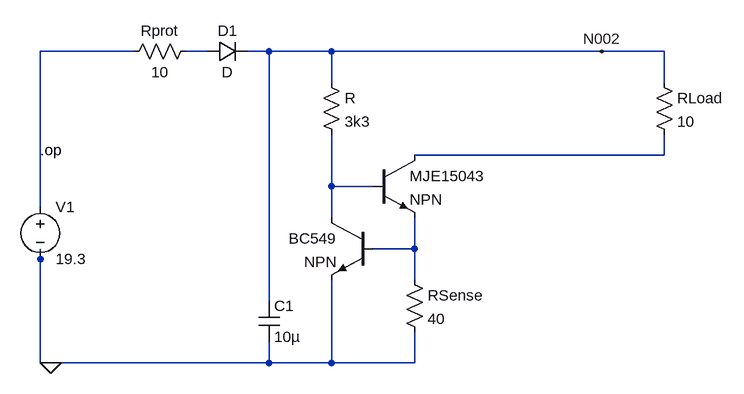
[diagram p0: schematic tty-20ma-current-source.asc]
tty-20ma-current-source.asc, the LTspice schematic file:
Version 4
SHEET 1 880 680
WIRE -64 16 -208 16
WIRE 48 16 16 16
WIRE 144 16 112 16
WIRE 240 16 144 16
WIRE 656 16 240 16
WIRE 752 16 656 16
WIRE 240 64 240 16
WIRE 752 64 752 16
WIRE 752 176 752 144
WIRE 752 176 368 176
WIRE 240 224 240 144
WIRE 304 224 240 224
WIRE -208 256 -208 16
WIRE 240 272 240 224
WIRE 368 320 368 272
WIRE 368 320 304 320
WIRE -208 336 -208 320
WIRE 368 368 368 320
WIRE 144 400 144 16
WIRE -208 496 -208 336
WIRE -192 496 -208 496
WIRE 144 496 144 464
WIRE 144 496 -192 496
WIRE 240 496 240 368
WIRE 240 496 144 496
WIRE 368 496 368 448
WIRE 368 496 240 496
FLAG 656 16 N002
FLAG -192 496 0
SYMBOL voltage -208 240 R0
SYMATTR InstName V1
SYMATTR Value 19.3
SYMBOL res 352 352 R0
SYMATTR InstName RSense
SYMATTR Value 40
SYMBOL cap 128 400 R0
SYMATTR InstName C1
SYMATTR Value 10µ
SYMBOL diode 48 32 R270
WINDOW 0 32 32 VTop 2
WINDOW 3 0 32 VBottom 2
SYMATTR InstName D1
SYMBOL res 736 48 R0
SYMATTR InstName RLoad
SYMATTR Value 10
SYMBOL npn3 304 176 R0
SYMATTR InstName MJE15043
SYMBOL res 224 48 R0
SYMATTR InstName R
SYMATTR Value 3k3
SYMBOL npn 304 272 M0
SYMATTR InstName BC549
SYMBOL res 32 0 R90
WINDOW 0 0 56 VBottom 2
WINDOW 3 32 56 VTop 2
SYMATTR InstName Rprot
SYMATTR Value 10
TEXT -208 168 Left 2 !.op

The netlist it stands for:
* tty-20ma-current-source.asc
V1 N001 0 19.3
RSense N006 0 40
C1 N002 0 10µ
D1 N003 N002 D
RLoad N002 N004 10
Q§MJE15043 N004 N005 N006 0 NPN
R N002 N005 3k3
Q§BC549 N005 N006 0 0 NPN
Rprot N003 N001 10
.model D D
.lib standard.dio
.model NPN NPN
.model PNP PNP
.lib standard.bjt
.op
.backanno
.end